# Altium schematic sheet 震动唤醒.SchDoc
size A4; DocumentNumber: 34; SheetNumber: 34; SheetTotal: 34
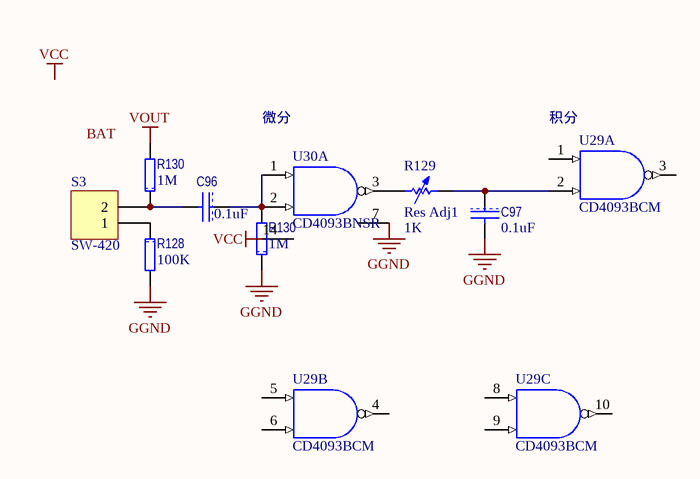
[diagram p0: 震动唤醒.SchDoc]

## Parts
(Parts that share a designator on the sheet are numbered #1, #2 ... from top to bottom, then left to right.)
C96  value 0.1uF  [1608[0603]C]  (hidden comment: C1608X7R1H104K)
C97  value 0.1uF  [1608[0603]C]  (hidden comment: C1608X7R1H104K)
R128  value 100K  [1608[0603]R]  (hidden comment: CRCW0603100KFKEA)
R129  Res Adj1  value 1K  [AXIAL-0.7]
R130#1  value 1M  [1608[0603]R]  (hidden comment: CRCW06031M00FKEA)
R130#2  value 1M  [1608[0603]R]  (hidden comment: CRCW06031M00FKEA)
S3  SW-420  [AXIAL-0.5]
U29  CD4093BCM  [M14A_N]  (parts A,B,C of 4)
U30  CD4093BNSR  [SOIC14_N]  (part A of 4)

## Nets
GGND: C97.2 R128.2 R130#2.1 U29.7(GND) U30.7(GND)  [also labelled GND]
VCC: U29.14(VCC) U30.14(VCC)
VOUT: R130#1.2
NetC96_1: C96.1 R130#2.2 U30.1(A) U30.2(B)
NetC96_2: C96.2 R130#1.1 S3.2
NetC97_1: C97.1 R129.2 U29.2(B)
NetR128_1: R128.1 S3.1
NetR129_1: R129.1 U30.3(J)

Not connected (* = marked no-connect by the designer): U29 1(A) 3(J) 4(K) 5(C) 6(D) 8(E) 9(F) 10(L)

## Notes on the sheet
- (near U30) 微分
- (near U29) 积分
- Labels drawn without touching a wire or pin: BAT, VCC

## Library data of the parts
C96 C97 = CAP: 多层陶瓷电容器MLCC - SMD/SMT 0603 0.1uF 50volts X7R 10%; Manufacturer: TDK; 产品: General Type MLCCs; 产品种类: Low & Medium Capacitance SMD Ceramic Chip Capacitors; 外壳代码 - in: 0603; 外壳代码 - mm: 1608; 封装 / 箱体: 0603 (1608 metric); 封装: Reel; 尺寸: 0.8 mm W x 1.6 mm L x 0.8 mm H; 工作温度范围: - 55 C to + 125 C; 标准包装数量: 4000; 电压额定值: 50 V; 电容-nF: 100 nF; 电容-pF: 100000 pF; 系列: C; Category: 多层陶瓷电容器MLCC - SMD/SMT; ComponentLink1Description: http://www.tdk.com/pdf/general_B11.pdf; ComponentLink1URL: http://www.tdk.com/pdf/general_B11.pdf; Description 1: 多层陶瓷电容器MLCC - SMD/SMT 0603 0.1uF 50volts X7R 10%; Manufacturer Part Number: C1608X7R1H104K; Minimum Order Quantity: 1; Pricing 1: 1=0.160, 50=0.070, 100=0.036, 500=0.019, 1000=0.013, 4000=0.010, 8000=0.009, 12000=0.008, 20000=0.007 (USD); Reeling: True; RoHS - 贸泽: Y; RoHS: RoHS Compliant; Stock 1: 224604; Supplier 1: Mouser; Supplier Part Number 1: 810-C1608X7R1H104K; 制造商: TDK; 容差: 10 %; 温度系数/代码: X7R; 电容: 0.1 uF; 端接类型: SMD/SMT
R128 = RES: 厚膜电阻器 - SMD 1/10watt 100Kohms 1%; Manufacturer: Vishay / Dale; 尺寸: 0.85 mm W x 1.55 mm L x 0.45 mm H; 工作温度范围: - 55 C to + 155 C; 封装 / 箱体: 0603 (1608 metric); 封装: Reel; 功率额定值: 100 mW; 产品: Thick Film Resistors SMD; 系列: CRCW; 温度系数: 100 PPM / K; 端接类型: SMD/SMT; 电压额定值: 75 V; 制造商: Vishay; 产品种类: 0603 Thick Film Chip Resistors; 标准包装数量: 5000; 外壳代码 - in: 0603; 外壳代码 - mm: 1608; Supplier 1: Mouser; Supplier Part Number 1: 71-CRCW0603-100K-E3; Manufacturer Part Number: CRCW0603100KFKEA; RoHS: RoHS Compliant By Exemption; Category: 厚膜电阻器 - SMD; Stock 1: 175756; Pricing 1: 1=0.080, 10=0.013, 100=0.010, 1000=0.008, 5000=0.005, 25000=0.004, 50000=0.003 (USD); 电阻: 100 kOhms; 容差: 1 %; RoHS - 贸泽: E; Minimum Order Quantity: 1; Reeling: True; ComponentLink1URL: http://www.mouser.com/ds/2/427/dcrcwe3-109170.pdf; ComponentLink1Description: http://www.mouser.com/ds/2/427/dcrcwe3-109170.pdf; Description 1: 厚膜电阻器 - SMD 1/10watt 100Kohms 1%
R129 = Res Adj1: Variable Resistor; Set Position: 0.5; Published: 8-Jun-2000; LatestRevisionDate: 17-Jul-2002; LatestRevisionNote: Re-released for DXP Platform.; PackageReference: AXIAL-0.7; Publisher: Altium Limited; PackageDescription: Axial Device, Thru-Hole; 2 Leads; 0.7 in Pin Spacing
R130#1 R130#2 = RES: 厚膜电阻器 - SMD 1/10watt 1.0Mohms 1%; Manufacturer: Vishay / Dale; 尺寸: 0.85 mm W x 1.55 mm L x 0.45 mm H; 工作温度范围: - 55 C to + 155 C; 封装 / 箱体: 0603 (1608 metric); 封装: Reel; 功率额定值: 100 mW; 产品: Thick Film Resistors SMD; 电阻: 1 MOhms; 系列: CRCW; 温度系数: 100 PPM / K; 端接类型: SMD/SMT; 电压额定值: 75 V; 外壳代码 - in: 0603; 外壳代码 - mm: 1608; 制造商: Vishay; 产品种类: 0603 Thick Film Chip Resistors; 标准包装数量: 5000; Supplier 1: Mouser; Supplier Part Number 1: 71-CRCW0603-1.0M-E3; Manufacturer Part Number: CRCW06031M00FKEA; RoHS: RoHS Compliant By Exemption; Category: 厚膜电阻器 - SMD; Stock 1: 71394; Pricing 1: 1=0.080, 10=0.013, 100=0.010, 1000=0.008, 5000=0.005, 25000=0.004, 50000=0.003 (USD); 容差: 1 %; RoHS - 贸泽: E; Minimum Order Quantity: 1; Reeling: True; ComponentLink1URL: http://www.mouser.com/ds/2/427/dcrcwe3-109170.pdf; ComponentLink1Description: http://www.mouser.com/ds/2/427/dcrcwe3-109170.pdf; Description 1: 厚膜电阻器 - SMD 1/10watt 1.0Mohms 1%
S3 = Header 2: 震动传感器; 公司: 百灵电子; LatestRevisionDate: 17-Jul-2002; LatestRevisionNote: Re-released for DXP Platform.; Publisher: Altium Limited
U29 = CD4093BCM: Quad 2-Input Schmitt-Trigger NAND Gate, 14-Pin SOIC; IC_Technology: C; Published: 17-Jul-2002; LatestRevisionDate: 13-Apr-2006; LatestRevisionNote: IPC-7351 Footprint Added.; DatasheetVersion: Jan-1999; PackageVersion: 2000; PackageReference: M14A; Publisher: Altium Limited; PackageDescription: 14-Pin Small Outline Integrated Circuit 1.27 mm Pitch; Code_IPC: SOIC127P600-14; ComponentLink1Description: Manufacturer Link; ComponentLink1URL: http://www.fairchildsemi.com/; ComponentLink2Description: Datasheet; ComponentLink2URL: http://www.fairchildsemi.com/ds/CD%2FCD4093BC.pdf
U30 = CD4093BCM: Quad 2-Input Schmitt-Trigger NAND Gate, 14-Pin SOIC; Manufacturer: Texas Instruments; Description 1: 逻辑门 Quad 2In Schmit Trgr; 封装 / 箱体: SOP-14; 封装: Reel; 逻辑系列: CD4000; 安装风格: SMD/SMT; 栅极数量: 4; 输入线路数量: 2; 线路数量（输入/输出）: 2 / 1; 输出线路数量: 1; 高电平输出电流: - 4.2 mA; 低电平输出电流: 4.2 mA; 最大工作温度: + 125 C; 最小工作温度: - 55 C; 产品种类: Logic - Gates; 传播延迟时间: 380 ns; 标准包装数量: 2000; 电源电压-最大: 18 V; 电源电压-最小: 3 V; Supplier 1: Mouser; Supplier Part Number 1: 595-CD4093BNSR; Manufacturer Part Number: CD4093BNSR; RoHS: RoHS Compliant; Category: 逻辑门; Stock 1: 2868; Pricing 1: 1=0.470, 10=0.360, 100=0.188, 1000=0.168, 2000=0.143, 10000=0.134, 50000=0.124, 100000=0.119 (USD); 产品: NAND; 制造商: Texas Instruments; RoHS - 贸泽: Y; Minimum Order Quantity: 1; Reeling: True; ComponentLink1URL: http://www.mouser.com/ds/2/405/schs115d-127166.pdf; ComponentLink1Description: http://www.mouser.com/ds/2/405/schs115d-127166.pdf